# Altium schematic sheet Base02.SchDoc: Base02
size A4; Organization: Elenze; Address1: Smart Pervasive Systems; Address2: elenze.com; Address3: technicalsupport@elenze.com; DocumentNumber: 01; Revision: 01.00.01; SheetNumber: 01; SheetTotal: 01
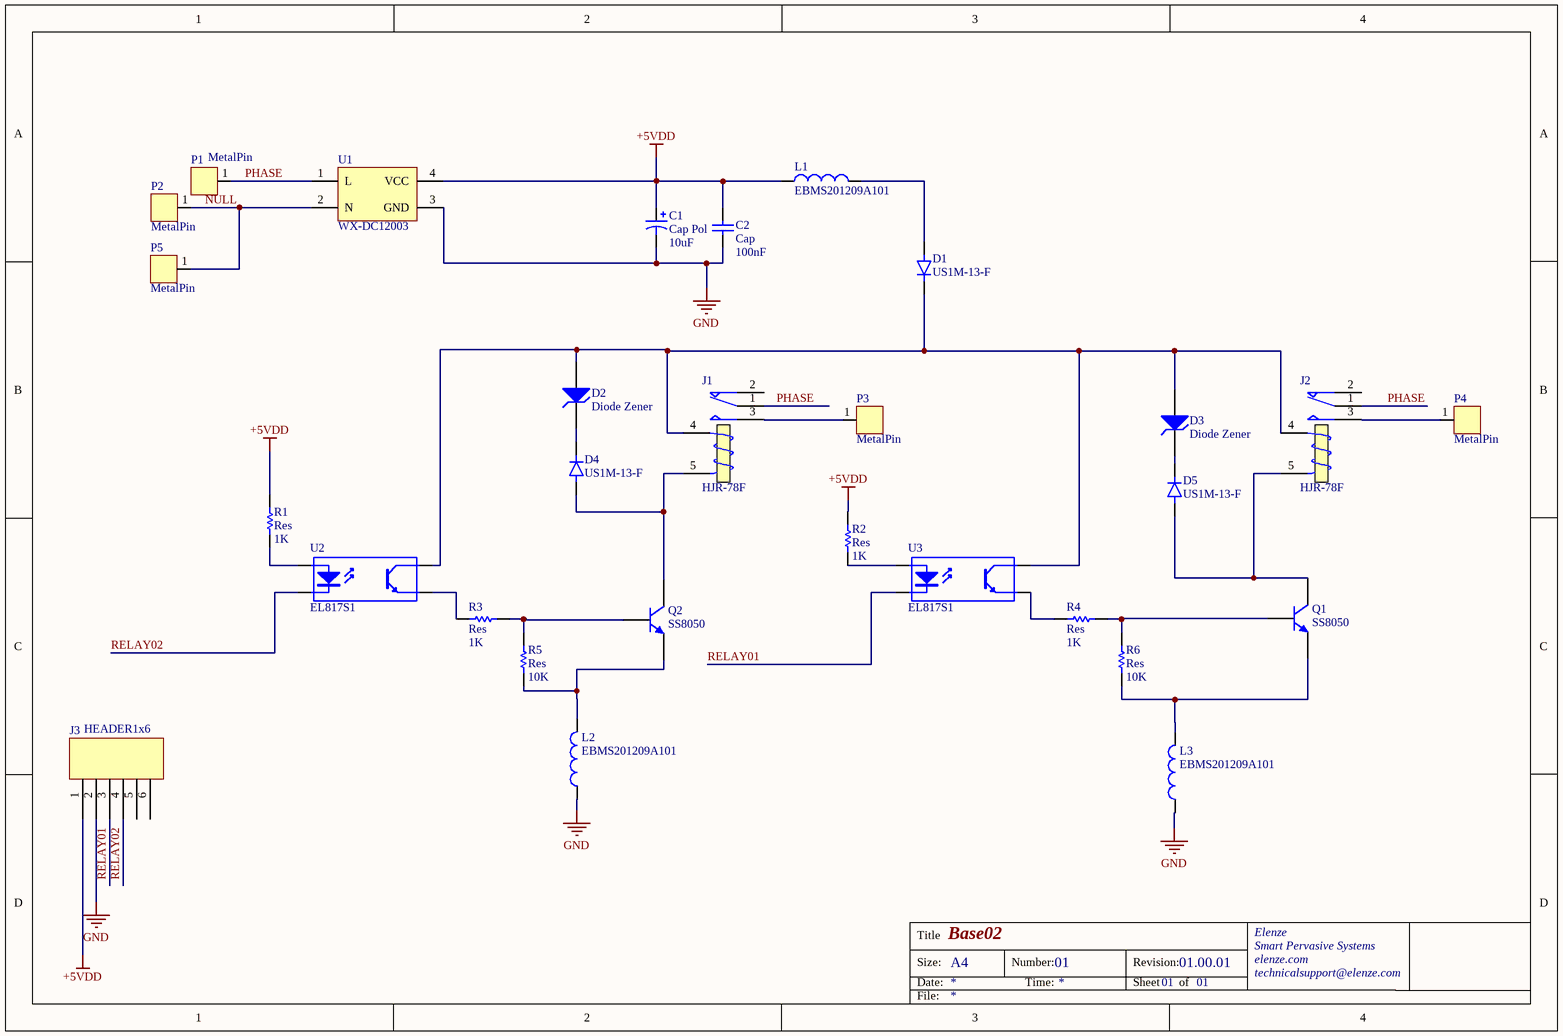
[diagram p0: Base02.SchDoc]

## Parts
C1  Cap Pol  value 10uF  [EL_C_4_5]
C2  Cap  value 100nF  [0402]
D1  US1M-13-F  [DIO_ES1J]
D2  Diode Zener  [DO1206]
D3  Diode Zener  [DO1206]
D4  US1M-13-F  [DIO_ES1J]
D5  US1M-13-F  [DIO_ES1J]
J1  HJR-78F  [RELAY]
J2  HJR-78F  [RELAY]
J3  HEADER1x6  [M-Header 6]
L1  EBMS201209A101  [IND0805]
L2  EBMS201209A101  [IND0805]
L3  EBMS201209A101  [IND0805]
P1  MetalPin  [MetalPin]
P2  MetalPin  [MetalPin]
P3  MetalPin  [MetalPin]
P4  MetalPin  [MetalPin]
P5  MetalPin  [MetalPin]
Q1  SS8050  [SOT-23]
Q2  SS8050  [SOT-23]
R1  Res  value 1K  [0402]
R2  Res  value 1K  [0402]
R3  Res  value 1K  [0402]
R4  Res  value 1K  [0402]
R5  Res  value 10K  [0402]
R6  Res  value 10K  [0402]
U1  WX-DC12003  [WX-DC12003]
U2  EL817S1  [SOIC254P1030X390-4N_EL817(S1)(A)(TU)-VG]
U3  EL817S1  [SOIC254P1030X390-4N_EL817(S1)(A)(TU)-VG]

## Nets
+5VDD: C1.1 C2.2 J3.1 L1.1 R1.1 R2.1 U1.4(VCC)
GND: C1.2 C2.1 J3.2 L2.1 L3.1 U1.3(GND)
NULL: P2.1 P5.1 U1.2(N)
PHASE: J1.1(COM) J2.1(COM) P1.1 U1.1(L)
RELAY01: J3.3 U3.2(K)
RELAY02: J3.4 U2.2(K)
NetD1_A: D1.A L1.2
NetD1_K: D1.K D2.1(A) D3.1(A) J1.4(T1) J2.4(T1) U2.4(C) U3.4(C)
NetD2_2: D2.2(K) D4.K
NetD3_2: D3.2(K) D5.K
NetD4_A: D4.A J1.5(T2) Q2.3(C)
NetD5_A: D5.A J2.5(T2) Q1.3(C)
NetJ1_3: J1.3(NO) P3.1
NetJ2_3: J2.3(NO) P4.1
NetL2_2: L2.2 Q2.2(E) R5.1
NetL3_2: L3.2 Q1.2(E) R6.1
NetQ1_1: Q1.1(B) R4.2 R6.2
NetQ2_1: Q2.1(B) R3.2 R5.2
NetR1_2: R1.2 U2.1(A)
NetR2_2: R2.2 U3.1(A)
NetR3_1: R3.1 U2.3(E)
NetR4_1: R4.1 U3.3(E)

Not connected (* = marked no-connect by the designer): J1 2(NC); J2 2(NC); J3 5 6

## Notes on the sheet
- Title
- Size:
- Date:
- A4
- Number:
- Time:
- Revision:
- Sheet
- of
- File:

## Library data of the parts
C1 = Cap Pol: Polarized Capacitor (Axial); Published: 8-Jun-2000; LatestRevisionDate: 17-Jul-2002; LatestRevisionNote: Re-released for DXP Platform.; PackageReference: POLAR0.8; Publisher: Altium Limited; PackageDescription: Polarized Capacitor; 2 Leads
C2 = Cap: Capacitor; Published: 8-Jun-2000; LatestRevisionDate: 17-Jul-2002; LatestRevisionNote: Re-released for DXP Platform.; PackageReference: RAD-0.3; Publisher: Altium Limited; PackageDescription: Radial Cap, Thru-Hole; 2 Leads; 0.3 in Pin Spacing
D1 D4 D5 = US1M-13-F: Diode Standard 1000V 1A Surface Mount SMA; MF: Diodes Inc.; Package: DO-214 Diodes Inc.; Value: *; Price: None; MP: US1M-13-F; Availability: Unavailable; SnapEDA_Link: https://www.snapeda.com/parts/US1M-13-F/Diodes%20Inc./view-part/270779/?ref=snap
D2 D3 = Diode Zener: Zener Diode; Published: 8-Jun-2000; LatestRevisionDate: 17-Jul-2002; LatestRevisionNote: Re-released for DXP Platform.; PackageReference: DIODE-0.7; Publisher: Altium Limited; PackageDescription: Diode, Thru-Hole; 2 Leads; 0.7 in Pin Spacing
J1 J2 = HJR-78F: 20A switching capability Small size auto Relay; Part Number: TRKM S-Z; Manufacturer: Tianbo; Package: Through Hole
J3 = HEADER1x6: HEADER 1x6
L1-L3 = INDUCTOR SMD
Q1 Q2 = SS8050: NPN General Purpose Amplifier; Published: 8-Jun-2000; LatestRevisionDate: 15-Jan-2003; LatestRevisionNote: PCB Footprint 'BCY-W3/D4.7' replaced; DatasheetVersion: 1997; PackageVersion: Sep-1998; PackageReference: TO-92A; Publisher: Altium Limited; PackageDescription: TO, Flat Index; 3 In-Line, Axial Leads; Body Dia. 4.5mm; Leads 0.51 x 0.48 mm (max); ComponentLink1Description: Manufacturer Link; ComponentLink1URL: http://www.fairchildsemi.com/; ComponentLink2Description: Datasheet; ComponentLink2URL: http://www.fairchildsemi.com/ds/2N%2F2N3904.pdf
R1-R6 = Res: Resistor; Published: 8-Jun-2000; LatestRevisionDate: 17-Jul-2002; LatestRevisionNote: Re-released for DXP Platform.; PackageReference: AXIAL-0.3; Publisher: Altium Limited; PackageDescription: Axial Device, Thru-Hole; 2 Leads; 0.3 in Pin Spacing
U1 = WX-DC12003: 85~265V AC to 5V 3.5W DC Isolated Power Supply Module; Manufacturer: Aerial telecommunications; Part Number: WX-DC12003; Package: Module
U2 U3 = EL817S1: 4 PIN DIP Phototransistor Photocoupler; Manufacturer: Everlight; Part Number: EL817S1; Package: Surface Mount Lead